# Altium schematic sheet io-bus.SchDoc: GECKO3 Power and I/O Bus
size A3; Organization: Berne University of Applied Science; Address1: School of Engineering and; Address2: Information Technology; Address3: Quellgasse 21; Address4: CH-2501 Biel; Revision: 1.0; SheetNumber: 7; SheetTotal: 19; ApprovedBy: zem1; Author: zac1
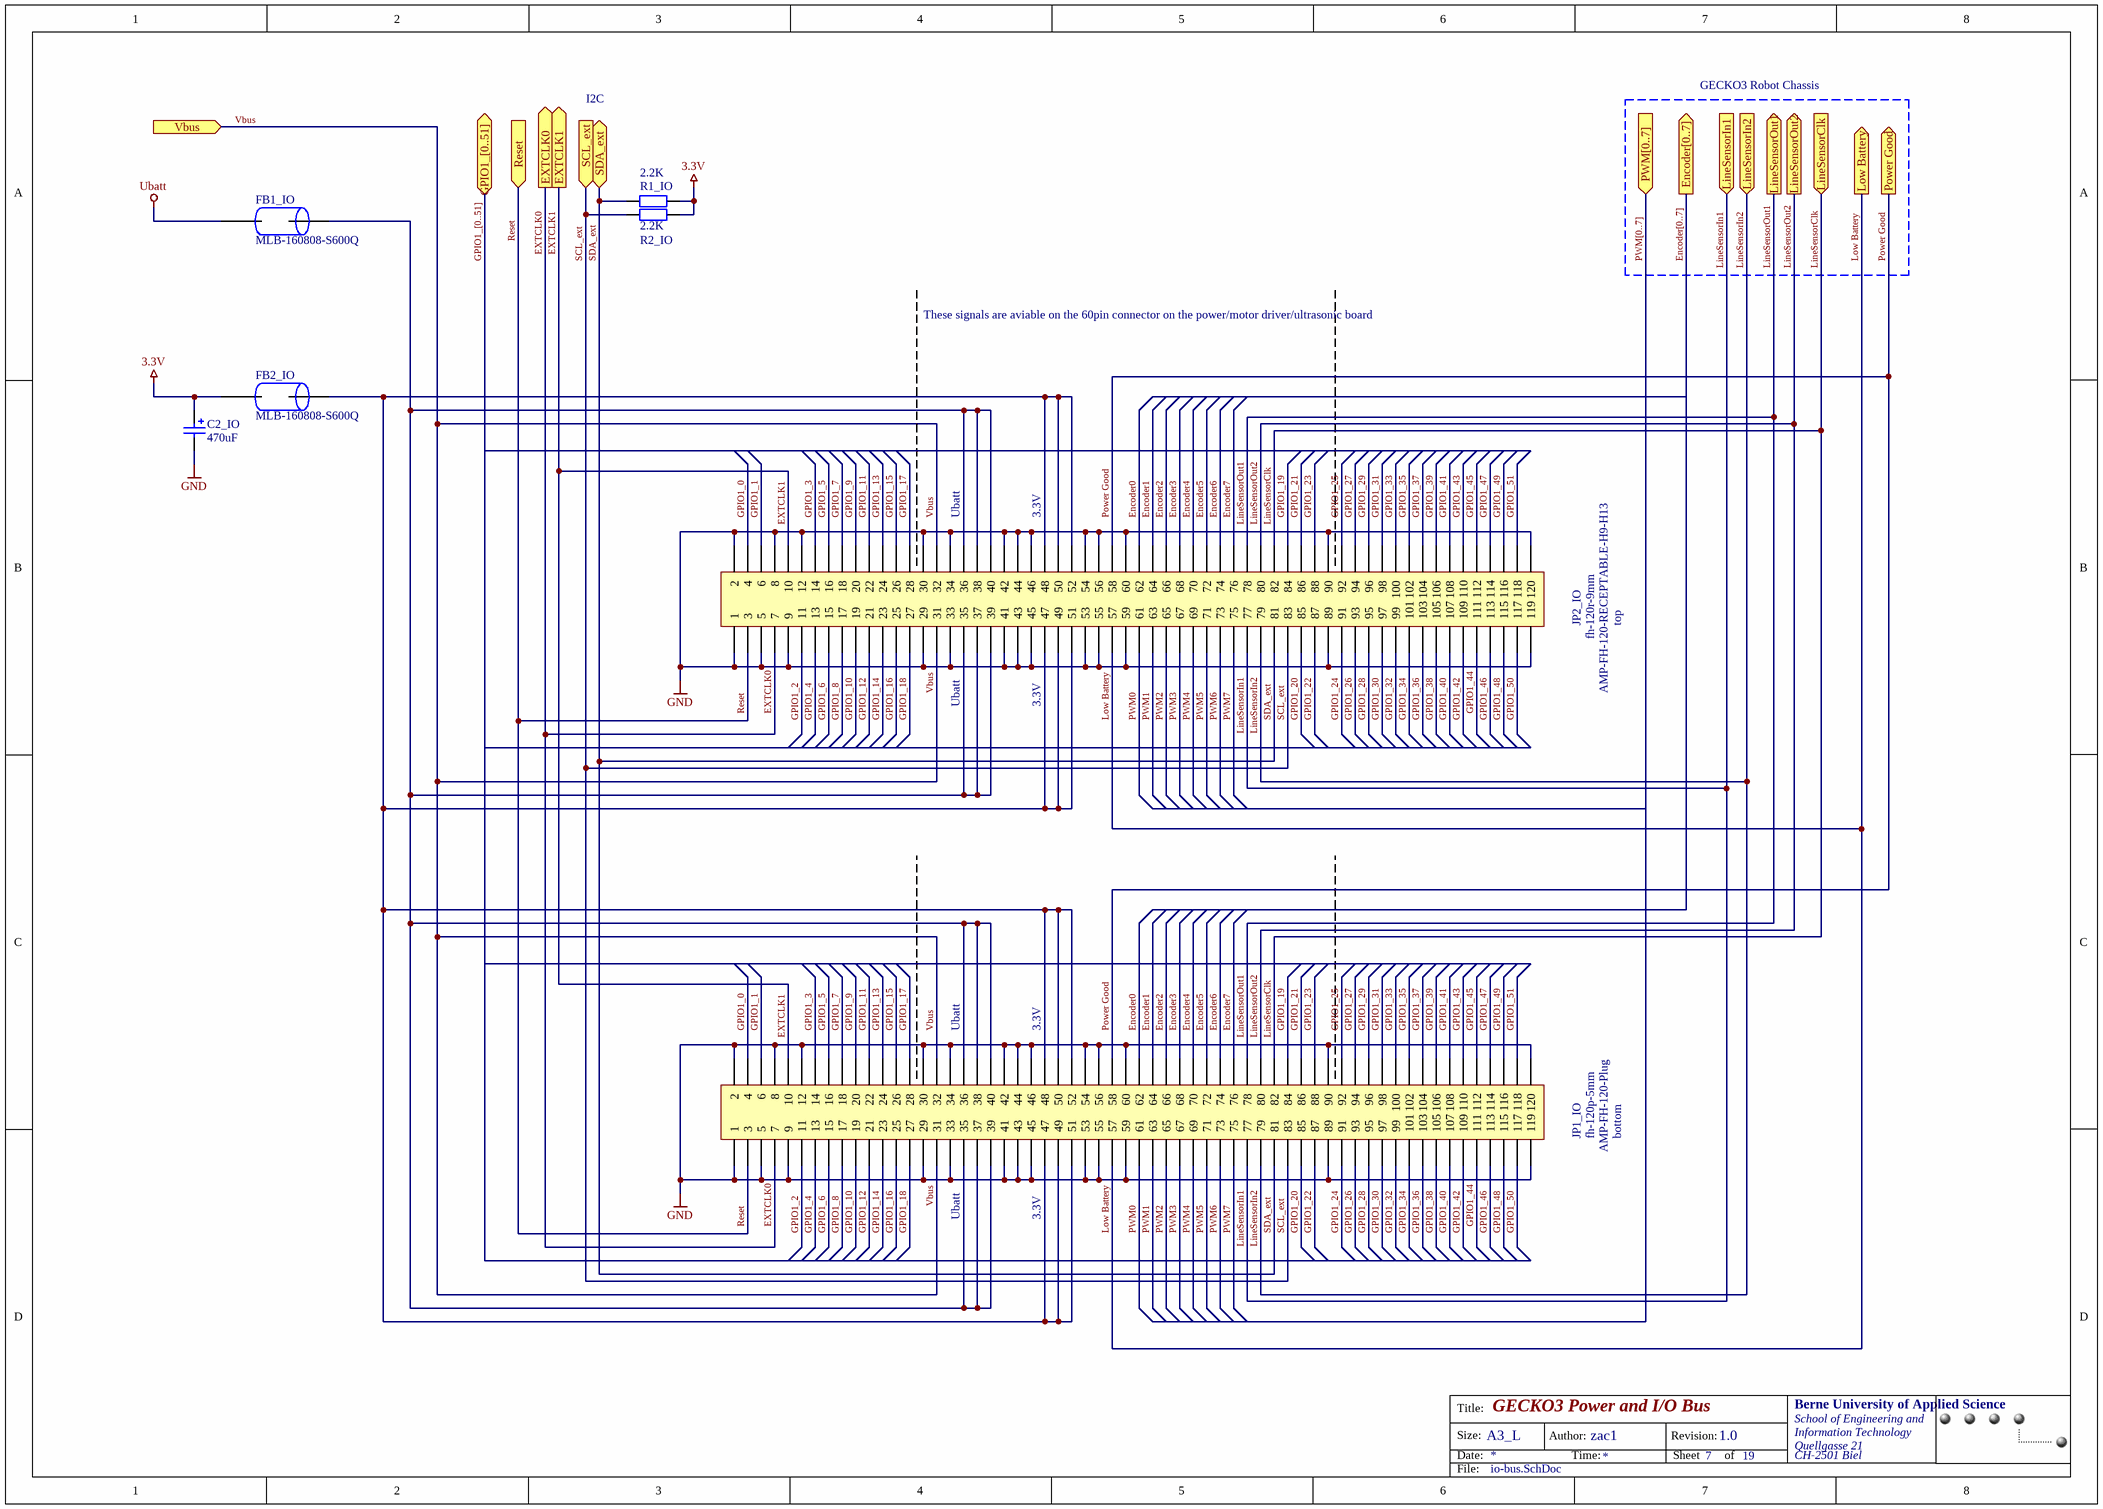
[diagram p0: io-bus.SchDoc]

## Parts
C2_IO  value 470uF  [D]  (hidden comment: Cap Pol3)
FB1_IO  value MLB-160808-S600Q  [0603]  (hidden comment: FERRITE-BEAD)
FB2_IO  value MLB-160808-S600Q  [0603]  (hidden comment: FERRITE-BEAD)
JP1_IO  AMP-FH-120-Plug  value fh-120p-5mm  Comment_1: bottom  [amp_FH_.8mm_120pin_plug]
JP2_IO  AMP-FH-120-RECEPTABLE-H9-H13  value fh-120r-9mm  Comment_1: top  [amp_FH_.8mm_120pin_r_H9_H13]
R1_IO  value 2.2K  [0402]  (hidden comment: Res2)
R2_IO  value 2.2K  [0402]  (hidden comment: Res2)

## Ports
Encoder[0..7] (out), EXTCLK0 (out), EXTCLK1 (out), GPIO1_[0..51] (bidir), LineSensorClk (in), LineSensorIn1 (in), LineSensorIn2 (in), LineSensorOut1 (out), LineSensorOut2 (out), Low Battery (out), Power Good (out), PWM[0..7] (in), Reset (in), SCL_ext (in), SDA_ext (bidir), Vbus (in)

## Nets
3.3V: C2_IO.1 FB2_IO.1 R1_IO.2 R2_IO.2
GND: C2_IO.2 JP1_IO.1 JP1_IO.2 JP1_IO.5 JP1_IO.8 JP1_IO.9 JP1_IO.12 JP1_IO.29 JP1_IO.30 JP1_IO.33 JP1_IO.34 JP1_IO.41 JP1_IO.42 JP1_IO.43 JP1_IO.44 JP1_IO.45 JP1_IO.46 JP1_IO.53 JP1_IO.54 JP1_IO.55 JP1_IO.56 JP1_IO.59 JP1_IO.60 JP1_IO.89 JP1_IO.90 JP1_IO.119 JP1_IO.120 JP2_IO.1 JP2_IO.2 JP2_IO.5 JP2_IO.8 JP2_IO.9 JP2_IO.12 JP2_IO.29 JP2_IO.30 JP2_IO.33 JP2_IO.34 JP2_IO.41 JP2_IO.42 JP2_IO.43 JP2_IO.44 JP2_IO.45 JP2_IO.46 JP2_IO.53 JP2_IO.54 JP2_IO.55 JP2_IO.56 JP2_IO.59 JP2_IO.60 JP2_IO.89 JP2_IO.90 JP2_IO.119 JP2_IO.120
Ubatt: FB1_IO.1
Encoder0: JP1_IO.62 JP2_IO.62
Encoder1: JP1_IO.64 JP2_IO.64
Encoder2: JP1_IO.66 JP2_IO.66
Encoder3: JP1_IO.68 JP2_IO.68
Encoder4: JP1_IO.70 JP2_IO.70
Encoder5: JP1_IO.72 JP2_IO.72
Encoder6: JP1_IO.74 JP2_IO.74
Encoder7: JP1_IO.76 JP2_IO.76
EXTCLK0: JP1_IO.7 JP2_IO.7 ; port EXTCLK0
EXTCLK1: JP1_IO.10 JP2_IO.10 ; port EXTCLK1
GPIO1_0: JP1_IO.4 JP2_IO.4
GPIO1_1: JP1_IO.6 JP2_IO.6
GPIO1_2: JP1_IO.11 JP2_IO.11
GPIO1_3: JP1_IO.14 JP2_IO.14
GPIO1_4: JP1_IO.13 JP2_IO.13
GPIO1_5: JP1_IO.16 JP2_IO.16
GPIO1_6: JP1_IO.15 JP2_IO.15
GPIO1_7: JP1_IO.18 JP2_IO.18
GPIO1_8: JP1_IO.17 JP2_IO.17
GPIO1_9: JP1_IO.20 JP2_IO.20
GPIO1_10: JP1_IO.19 JP2_IO.19
GPIO1_11: JP1_IO.22 JP2_IO.22
GPIO1_12: JP1_IO.21 JP2_IO.21
GPIO1_13: JP1_IO.24 JP2_IO.24
GPIO1_14: JP1_IO.23 JP2_IO.23
GPIO1_15: JP1_IO.26 JP2_IO.26
GPIO1_16: JP1_IO.25 JP2_IO.25
GPIO1_17: JP1_IO.28 JP2_IO.28
GPIO1_18: JP1_IO.27 JP2_IO.27
GPIO1_19: JP1_IO.84 JP2_IO.84
GPIO1_20: JP1_IO.85 JP2_IO.85
GPIO1_21: JP1_IO.86 JP2_IO.86
GPIO1_22: JP1_IO.87 JP2_IO.87
GPIO1_23: JP1_IO.88 JP2_IO.88
GPIO1_24: JP1_IO.91 JP2_IO.91
GPIO1_25: JP1_IO.92 JP2_IO.92
GPIO1_26: JP1_IO.93 JP2_IO.93
GPIO1_27: JP1_IO.94 JP2_IO.94
GPIO1_28: JP1_IO.95 JP2_IO.95
GPIO1_29: JP1_IO.96 JP2_IO.96
GPIO1_30: JP1_IO.97 JP2_IO.97
GPIO1_31: JP1_IO.98 JP2_IO.98
GPIO1_32: JP1_IO.99 JP2_IO.99
GPIO1_33: JP1_IO.100 JP2_IO.100
GPIO1_34: JP1_IO.101 JP2_IO.101
GPIO1_35: JP1_IO.102 JP2_IO.102
GPIO1_36: JP1_IO.103 JP2_IO.103
GPIO1_37: JP1_IO.104 JP2_IO.104
GPIO1_38: JP1_IO.105 JP2_IO.105
GPIO1_39: JP1_IO.106 JP2_IO.106
GPIO1_40: JP1_IO.107 JP2_IO.107
GPIO1_41: JP1_IO.108 JP2_IO.108
GPIO1_42: JP1_IO.109 JP2_IO.109
GPIO1_43: JP1_IO.110 JP2_IO.110
GPIO1_44: JP1_IO.111 JP2_IO.111
GPIO1_45: JP1_IO.112 JP2_IO.112
GPIO1_46: JP1_IO.113 JP2_IO.113
GPIO1_47: JP1_IO.114 JP2_IO.114
GPIO1_48: JP1_IO.115 JP2_IO.115
GPIO1_49: JP1_IO.116 JP2_IO.116
GPIO1_50: JP1_IO.117 JP2_IO.117
GPIO1_51: JP1_IO.118 JP2_IO.118
LineSensorClk: JP1_IO.82 JP2_IO.82 ; port LineSensorClk
LineSensorIn1: JP1_IO.77 JP2_IO.77 ; port LineSensorIn1
LineSensorIn2: JP1_IO.79 JP2_IO.79 ; port LineSensorIn2
LineSensorOut1: JP1_IO.78 JP2_IO.78 ; port LineSensorOut1
LineSensorOut2: JP1_IO.80 JP2_IO.80 ; port LineSensorOut2
Low Battery: JP1_IO.57 JP2_IO.57 ; port Low Battery
Power Good: JP1_IO.58 JP2_IO.58 ; port Power Good
PWM0: JP1_IO.61 JP2_IO.61
PWM1: JP1_IO.63 JP2_IO.63
PWM2: JP1_IO.65 JP2_IO.65
PWM3: JP1_IO.67 JP2_IO.67
PWM4: JP1_IO.69 JP2_IO.69
PWM5: JP1_IO.71 JP2_IO.71
PWM6: JP1_IO.73 JP2_IO.73
PWM7: JP1_IO.75 JP2_IO.75
Reset: JP1_IO.3 JP2_IO.3 ; port Reset
SCL_ext: JP1_IO.83 JP2_IO.83 R2_IO.1 ; port SCL_ext
SDA_ext: JP1_IO.81 JP2_IO.81 R1_IO.1 ; port SDA_ext
Vbus: JP1_IO.31 JP1_IO.32 JP2_IO.31 JP2_IO.32 ; port Vbus
NetFB1_IO_2: FB1_IO.2 JP1_IO.35 JP1_IO.36 JP1_IO.37 JP1_IO.38 JP1_IO.39 JP1_IO.40 JP2_IO.35 JP2_IO.36 JP2_IO.37 JP2_IO.38 JP2_IO.39 JP2_IO.40
NetFB2_IO_2: FB2_IO.2 JP1_IO.47 JP1_IO.48 JP1_IO.49 JP1_IO.50 JP1_IO.51 JP1_IO.52 JP2_IO.47 JP2_IO.48 JP2_IO.49 JP2_IO.50 JP2_IO.51 JP2_IO.52

## Buses and harness runs
bus Encoder[0..7] = port Encoder[0..7]
bus GPIO1_[0..51] = port GPIO1_[0..51]
bus PWM[0..7] = port PWM[0..7]

## Notes on the sheet
- I2C
- GECKO3 Robot Chassis
- These signals are aviable on the 60pin connector on the power/motor driver/ultrasonic board
- Ubatt
- 3.3V
- (near JP2_IO) Ubatt
- (near JP1_IO) Ubatt
- Title:
- Size:
- Date:
- A3_L
- Author:
- Time:
- Revision:
- Sheet
- of
- File:

## Library data of the parts
C2_IO = Cap Pol3: Polarized Capacitor (Surface Mount); Manufacturer: Kemet; Part Number: B45196-H2477-K509; Class I: Passive; Currency: CHF; Packaging unit: 1; Published: 8-Jun-2000; Revision: July-2002: Re-released for DXP Platform.; Publisher: Altium Limited; Class II: Capacitor; Distributor Number: 811 024; RoHS: yes; Distributor: Distrelec; Price: 3.77
FB1_IO FB2_IO = FERRITE-BEAD: Manufacturer: Kitagawa; Currency: CHF; Packaging unit: 5; Distributor Number: 330 131; Part Number: MLB-160808-S600Q; RoHS: yes; Distributor: Distrelec; Price: 0.75
JP1_IO = AMP-FH-120-Plug: AMP Free Height System, 0.8mm, 120 Pin, Plug; Part Number: 5177984-5; Currency: CHF; Packaging unit: 1; Manufacturer: AMP; RoHS: yes; Distributor: Farnell; Distributor Number: 1098 339; Price: 7.95
JP2_IO = AMP-FH-120-RECEPTABLE-H9-H13: AMP Free Height System, 0.8mm, 120 Pin, 9 or 13mm Height, Receptable; Part Number: 5-5179009-5; Currency: CHF; Packaging unit: 1; Manufacturer: AMP; RoHS: yes; Distributor: Farnell; Distributor Number: 1098 355; Price: 6.85
R1_IO R2_IO = Res2: Resistor; Manufacturer: PHYCOMP; Part Number: 232270672202; Class I: Passive; Currency: CHF; Packaging unit: 50; Published: 8-Jun-2000; Revision: July-2002: Re-released for DXP Platform.; Publisher: Altium Limited; Class II: Resistor; Distributor Number: 9239 278; RoHS: yes; Distributor: Farnell; Price: 0.12